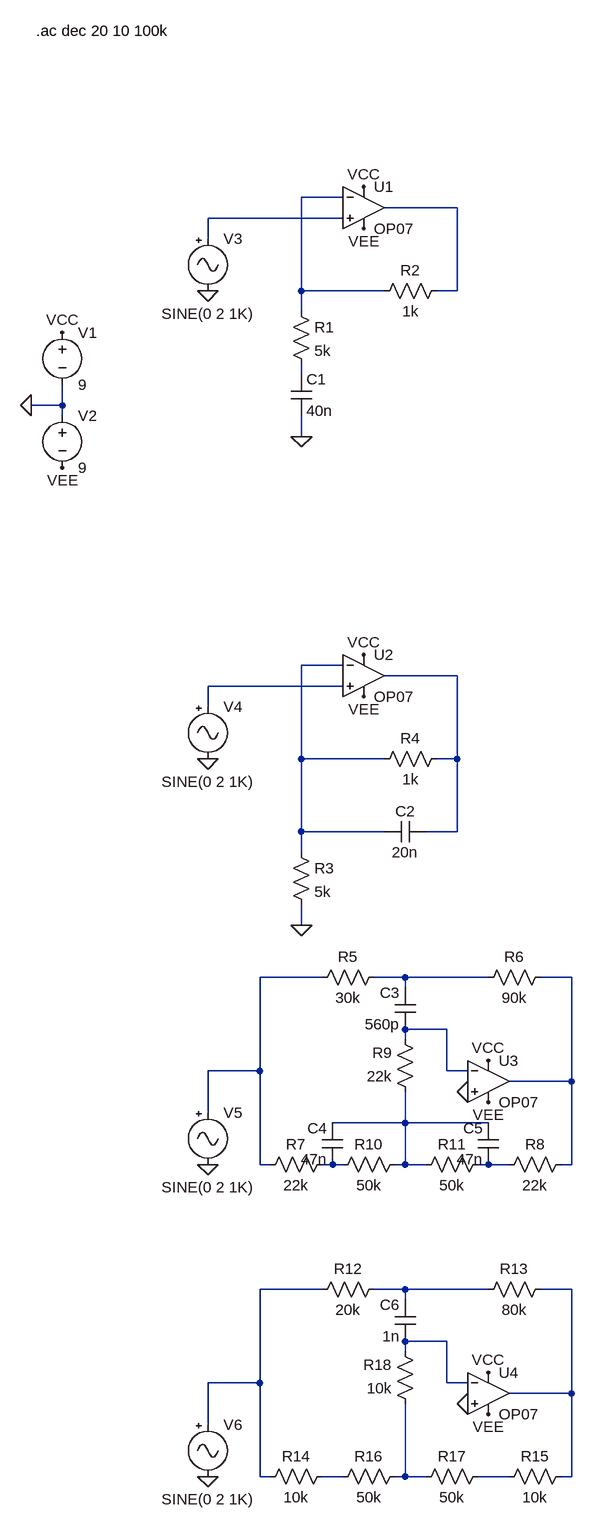
[diagram p0: schematic tone_treble.asc]
tone_treble.asc, the LTspice schematic file:
Version 4
SHEET 1 884 2304
WIRE 432 288 368 288
WIRE 608 304 496 304
WIRE 432 320 224 320
WIRE 224 352 224 320
WIRE 368 432 368 288
WIRE 496 432 368 432
WIRE 608 432 608 304
WIRE 608 432 576 432
WIRE 368 464 368 432
WIRE 368 560 368 544
WIRE 0 608 0 576
WIRE 0 608 -48 608
WIRE 0 624 0 608
WIRE 368 656 368 624
WIRE 432 1008 368 1008
WIRE 608 1024 496 1024
WIRE 432 1040 224 1040
WIRE 224 1072 224 1040
WIRE 368 1152 368 1008
WIRE 496 1152 368 1152
WIRE 608 1152 608 1024
WIRE 608 1152 576 1152
WIRE 368 1264 368 1152
WIRE 496 1264 368 1264
WIRE 608 1264 608 1152
WIRE 608 1264 560 1264
WIRE 368 1296 368 1264
WIRE 368 1408 368 1376
WIRE 400 1488 304 1488
WIRE 528 1488 480 1488
WIRE 656 1488 528 1488
WIRE 784 1488 736 1488
WIRE 528 1504 528 1488
WIRE 592 1568 528 1568
WIRE 528 1584 528 1568
WIRE 304 1632 304 1488
WIRE 304 1632 224 1632
WIRE 592 1632 592 1568
WIRE 624 1632 592 1632
WIRE 784 1648 784 1488
WIRE 784 1648 688 1648
WIRE 224 1696 224 1632
WIRE 528 1712 528 1664
WIRE 528 1712 416 1712
WIRE 656 1712 528 1712
WIRE 304 1776 304 1632
WIRE 320 1776 304 1776
WIRE 416 1776 400 1776
WIRE 432 1776 416 1776
WIRE 528 1776 528 1712
WIRE 528 1776 512 1776
WIRE 560 1776 528 1776
WIRE 656 1776 640 1776
WIRE 688 1776 656 1776
WIRE 784 1776 784 1648
WIRE 784 1776 768 1776
WIRE 400 1968 304 1968
WIRE 528 1968 480 1968
WIRE 656 1968 528 1968
WIRE 784 1968 736 1968
WIRE 528 1984 528 1968
WIRE 592 2048 528 2048
WIRE 528 2064 528 2048
WIRE 304 2112 304 1968
WIRE 304 2112 224 2112
WIRE 592 2112 592 2048
WIRE 624 2112 592 2112
WIRE 784 2128 784 1968
WIRE 784 2128 688 2128
WIRE 224 2176 224 2112
WIRE 304 2256 304 2112
WIRE 320 2256 304 2256
WIRE 432 2256 400 2256
WIRE 528 2256 528 2144
WIRE 528 2256 512 2256
WIRE 560 2256 528 2256
WIRE 688 2256 640 2256
WIRE 784 2256 784 2128
WIRE 784 2256 768 2256
FLAG 464 272 VCC
FLAG 464 336 VEE
FLAG 0 496 VCC
FLAG -48 608 0
FLAG 0 704 VEE
FLAG 368 656 0
FLAG 224 432 0
FLAG 464 992 VCC
FLAG 464 1056 VEE
FLAG 368 1408 0
FLAG 224 1152 0
FLAG 656 1616 VCC
FLAG 656 1680 VEE
FLAG 224 1776 0
FLAG 624 1664 0
FLAG 656 2096 VCC
FLAG 656 2160 VEE
FLAG 224 2256 0
FLAG 624 2144 0
SYMBOL OpAmps/OP07 464 240 R0
SYMATTR InstName U1
SYMBOL voltage 0 480 R0
SYMATTR InstName V1
SYMATTR Value 9
SYMBOL voltage 0 608 R0
SYMATTR InstName V2
SYMATTR Value 9
SYMBOL res 352 448 R0
SYMATTR InstName R1
SYMATTR Value 5k
SYMBOL res 592 416 R90
WINDOW 0 0 56 VBottom 2
WINDOW 3 32 56 VTop 2
SYMATTR InstName R2
SYMATTR Value 1k
SYMBOL Misc/signal 224 336 R0
WINDOW 3 -71 131 Left 2
SYMATTR Value SINE(0 2 1K)
SYMATTR InstName V3
SYMATTR Value2 AC 2
SYMBOL cap 352 560 R0
SYMATTR InstName C1
SYMATTR Value 40n
SYMBOL OpAmps/OP07 464 960 R0
SYMATTR InstName U2
SYMBOL res 352 1280 R0
SYMATTR InstName R3
SYMATTR Value 5k
SYMBOL res 592 1136 R90
WINDOW 0 0 56 VBottom 2
WINDOW 3 32 56 VTop 2
SYMATTR InstName R4
SYMATTR Value 1k
SYMBOL Misc/signal 224 1056 R0
WINDOW 3 -71 131 Left 2
SYMATTR Value SINE(0 2 1K)
SYMATTR InstName V4
SYMATTR Value2 AC 2
SYMBOL cap 560 1248 R90
WINDOW 0 0 32 VBottom 2
WINDOW 3 32 32 VTop 2
SYMATTR InstName C2
SYMATTR Value 20n
SYMBOL OpAmps/OP07 656 1584 R0
SYMATTR InstName U3
SYMBOL Misc/signal 224 1680 R0
WINDOW 3 -71 131 Left 2
SYMATTR Value SINE(0 2 1K)
SYMATTR InstName V5
SYMATTR Value2 AC 2
SYMBOL res 496 1472 R90
WINDOW 0 0 56 VBottom 2
WINDOW 3 32 56 VTop 2
SYMATTR InstName R5
SYMATTR Value 30k
SYMBOL res 752 1472 R90
WINDOW 0 0 56 VBottom 2
WINDOW 3 32 56 VTop 2
SYMATTR InstName R6
SYMATTR Value 90k
SYMBOL res 416 1760 R90
WINDOW 0 0 56 VBottom 2
WINDOW 3 32 56 VTop 2
SYMATTR InstName R7
SYMATTR Value 22k
SYMBOL res 784 1760 R90
WINDOW 0 0 56 VBottom 2
WINDOW 3 32 56 VTop 2
SYMATTR InstName R8
SYMATTR Value 22k
SYMBOL cap 544 1568 R180
WINDOW 0 24 56 Left 2
WINDOW 3 24 8 Left 2
SYMATTR InstName C3
SYMATTR Value 560p
SYMBOL res 528 1760 R90
WINDOW 0 0 56 VBottom 2
WINDOW 3 32 56 VTop 2
SYMATTR InstName R10
SYMATTR Value 50k
SYMBOL res 656 1760 R90
WINDOW 0 0 56 VBottom 2
WINDOW 3 32 56 VTop 2
SYMATTR InstName R11
SYMATTR Value 50k
SYMBOL cap 432 1776 R180
WINDOW 0 24 56 Left 2
WINDOW 3 24 8 Left 2
SYMATTR InstName C4
SYMATTR Value 47n
SYMBOL cap 672 1776 R180
WINDOW 0 24 56 Left 2
WINDOW 3 24 8 Left 2
SYMATTR InstName C5
SYMATTR Value 47n
SYMBOL res 544 1680 R180
WINDOW 0 36 76 Left 2
WINDOW 3 36 40 Left 2
SYMATTR InstName R9
SYMATTR Value 22k
SYMBOL OpAmps/OP07 656 2064 R0
SYMATTR InstName U4
SYMBOL Misc/signal 224 2160 R0
WINDOW 3 -71 131 Left 2
SYMATTR Value SINE(0 2 1K)
SYMATTR InstName V6
SYMATTR Value2 AC 2
SYMBOL res 496 1952 R90
WINDOW 0 0 56 VBottom 2
WINDOW 3 32 56 VTop 2
SYMATTR InstName R12
SYMATTR Value 20k
SYMBOL res 752 1952 R90
WINDOW 0 0 56 VBottom 2
WINDOW 3 32 56 VTop 2
SYMATTR InstName R13
SYMATTR Value 80k
SYMBOL res 416 2240 R90
WINDOW 0 0 56 VBottom 2
WINDOW 3 32 56 VTop 2
SYMATTR InstName R14
SYMATTR Value 10k
SYMBOL res 784 2240 R90
WINDOW 0 0 56 VBottom 2
WINDOW 3 32 56 VTop 2
SYMATTR InstName R15
SYMATTR Value 10k
SYMBOL cap 544 2048 R180
WINDOW 0 24 56 Left 2
WINDOW 3 24 8 Left 2
SYMATTR InstName C6
SYMATTR Value 1n
SYMBOL res 528 2240 R90
WINDOW 0 0 56 VBottom 2
WINDOW 3 32 56 VTop 2
SYMATTR InstName R16
SYMATTR Value 50k
SYMBOL res 656 2240 R90
WINDOW 0 0 56 VBottom 2
WINDOW 3 32 56 VTop 2
SYMATTR InstName R17
SYMATTR Value 50k
SYMBOL res 544 2160 R180
WINDOW 0 36 76 Left 2
WINDOW 3 36 40 Left 2
SYMATTR InstName R18
SYMATTR Value 10k
TEXT -40 32 Left 2 !.ac dec 20 10 100k

The netlist it stands for:
* tone_treble.asc
XU1 N003 N001 VCC VEE N002 LT1001  ; OP07, pins In+ In- V+ V- OUT
V1 VCC 0 9
V2 0 VEE 9
R1 N001 N004 5k
R2 N002 N001 1k
V3 N003 0 SINE(0 2 1K) AC 2
C1 N004 0 40n
XU2 N007 N005 VCC VEE N006 LT1001  ; OP07, pins In+ In- V+ V- OUT
R3 N005 0 5k
R4 N006 N005 1k
V4 N007 0 SINE(0 2 1K) AC 2
C2 N006 N005 20n
XU3 0 N011 VCC VEE N010 LT1001  ; OP07, pins In+ In- V+ V- OUT
V5 N008 0 SINE(0 2 1K) AC 2
R5 N009 N008 30k
R6 N010 N009 90k
R7 N013 N008 22k
R8 N010 N014 22k
C3 N011 N009 560p
R10 N012 N013 50k
R11 N014 N012 50k
C4 N013 N012 47n
C5 N014 N012 47n
R9 N012 N011 22k
XU4 0 N018 VCC VEE N017 LT1001  ; OP07, pins In+ In- V+ V- OUT
V6 N015 0 SINE(0 2 1K) AC 2
R12 N016 N015 20k
R13 N017 N016 80k
R14 N019 N015 10k
R15 N017 N021 10k
C6 N018 N016 1n
R16 N020 N019 50k
R17 N021 N020 50k
R18 N020 N018 10k
.ac dec 20 10 100k
.lib LTC.lib
.backanno
.end